# Altium schematic sheet CW340_FTDI.SchDoc: FTDI Controller
size Letter; Organization: NewAE Technology Inc.; Address1: 1083 Queen St., Suite 196; Address2: Halifax; Address3: NS; Address4: Canada B3H 0B2; DocumentNumber: .; Revision: .; SheetApproved: NO
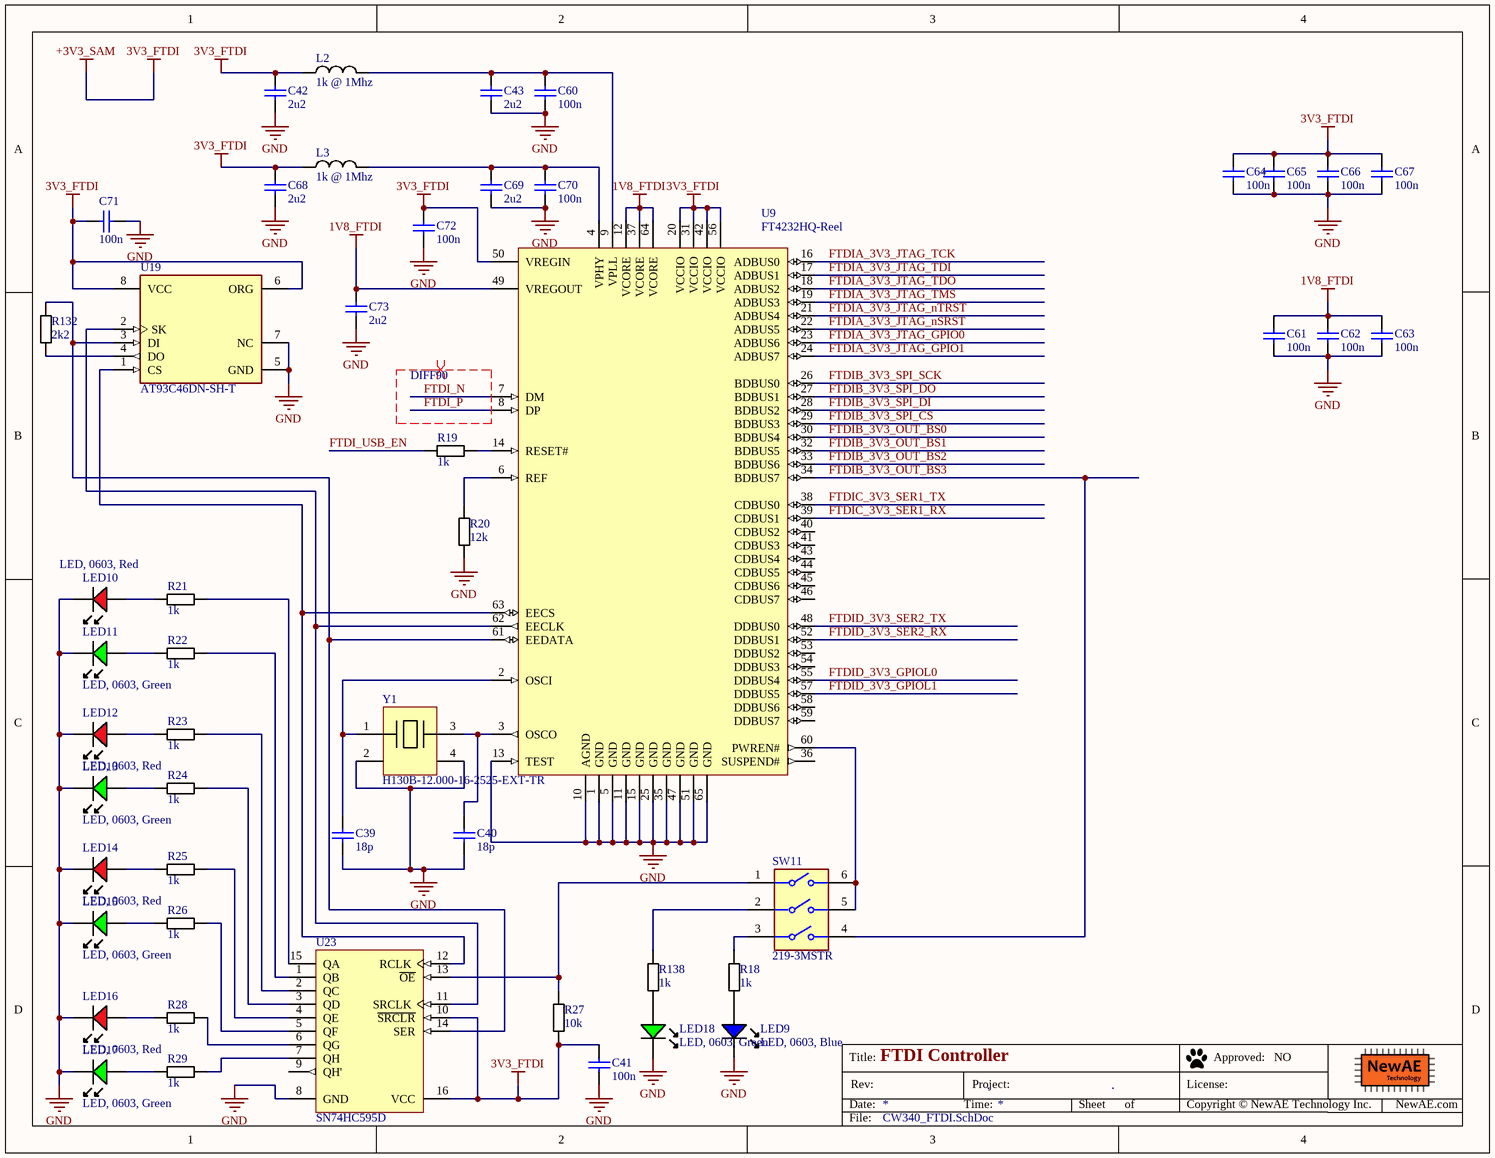
[diagram p0: CW340_FTDI.SchDoc]

## Parts
C39  18p  [CAPC0402_M]
C40  18p  [CAPC0402_M]
C41  100n  [CAPC0402_M]
C42  2u2  [CAPC0603_M]
C43  2u2  [CAPC0603_M]
C60  100n  [CAPC0402_M]
C61  100n  [CAPC0402_M]
C62  100n  [CAPC0402_M]
C63  100n  [CAPC0402_M]
C64  100n  [CAPC0402_M]
C65  100n  [CAPC0402_M]
C66  100n  [CAPC0402_M]
C67  100n  [CAPC0402_M]
C68  2u2  [CAPC0603_M]
C69  2u2  [CAPC0603_M]
C70  100n  [CAPC0402_M]
C71  100n  [CAPC0402_M]
C72  100n  [CAPC0402_M]
C73  2u2  [CAPC0603_M]
L2  1k @ 1Mhz  [IND_0603]
L3  1k @ 1Mhz  [IND_0603]
LED9  LED, 0603, Blue  [LED-0603-BLUE]
LED10  LED, 0603, Red  [LED-0603-RED]
LED11  LED, 0603, Green  [LED-0603-GREEN]
LED12  LED, 0603, Red  [LED-0603-RED]
LED13  LED, 0603, Green  [LED-0603-GREEN]
LED14  LED, 0603, Red  [LED-0603-RED]
LED15  LED, 0603, Green  [LED-0603-GREEN]
LED16  LED, 0603, Red  [LED-0603-RED]
LED17  LED, 0603, Green  [LED-0603-GREEN]
LED18  LED, 0603, Green  [LED-0603-GREEN]
R18  1k  [RESC1005X40N]
R19  1k  [RESC1005X40N]
R20  12k  [RESC1608X55N]
R21  1k  [RESC1005X40N]
R22  1k  [RESC1005X40N]
R23  1k  [RESC1005X40N]
R24  1k  [RESC1005X40N]
R25  1k  [RESC1005X40N]
R26  1k  [RESC1005X40N]
R27  10k  [RESC1005X40N]
R28  1k  [RESC1005X40N]
R29  1k  [RESC1005X40N]
R132  2k2  [RESC1005X40N]
R138  1k  [RESC1005X40N]
SW11  219-3MSTR  [FP-219-3MSTR-MFG]
U9  FT4232HQ-Reel  [QFN64_2_L]
U19  AT93C46DN-SH-T  [FP-C04-057-SN-MFG]
U23  SN74HC595D  [D0016A_L]
Y1  H130B-12.000-16-2525-EXT-TR  [5x3.2MM XTAL]

## Nets
1V8_FTDI: C61.1 C62.1 C63.1 C73.1 U9.12(VCORE) U9.37(VCORE) U9.49(VREGOUT) U9.64(VCORE)
+3V3_SAM: C41.1 C42.1 C64.1 C65.1 C66.1 C67.1 C68.1 C71.1 C72.1 L2.1 L3.1 R27.2 U9.20(VCCIO) U9.31(VCCIO) U9.42(VCCIO) U9.50(VREGIN) U9.56(VCCIO) U19.6(ORG) U19.8(VCC) U23.10(~{SRCLR}) U23.16(VCC)  [also labelled 3V3_FTDI]
GND: C39.2 C40.2 C41.2 C42.2 C43.2 C60.2 C61.2 C62.2 C63.2 C64.2 C65.2 C66.2 C67.2 C68.2 C69.2 C70.2 C71.2 C72.2 C73.2 LED9.K LED10.K LED11.K LED12.K LED13.K LED14.K LED15.K LED16.K LED17.K LED18.K R20.2 U9.1(GND) U9.5(GND) U9.10(AGND) U9.11(GND) U9.13(TEST) U9.15(GND) U9.25(GND) U9.35(GND) U9.47(GND) U9.51(GND) U9.65(GND) U19.5(GND) U19.7(NC) U23.8(GND) Y1.2 Y1.4
FTDI_N: U9.7(DM)
FTDI_P: U9.8(DP)
FTDI_USB_EN: R19.2
FTDIA_3V3_JTAG_GPIO0: U9.23(ADBUS6)
FTDIA_3V3_JTAG_GPIO1: U9.24(ADBUS7)
FTDIA_3V3_JTAG_nSRST: U9.22(ADBUS5)
FTDIA_3V3_JTAG_nTRST: U9.21(ADBUS4)
FTDIA_3V3_JTAG_TCK: U9.16(ADBUS0)
FTDIA_3V3_JTAG_TDI: U9.17(ADBUS1)
FTDIA_3V3_JTAG_TDO: U9.18(ADBUS2)
FTDIA_3V3_JTAG_TMS: U9.19(ADBUS3)
FTDIB_3V3_OUT_BS0: U9.30(BDBUS4)
FTDIB_3V3_OUT_BS1: U9.32(BDBUS5)
FTDIB_3V3_OUT_BS2: U9.33(BDBUS6)
FTDIB_3V3_OUT_BS3: SW11.4 U9.34(BDBUS7)
FTDIB_3V3_SPI_CS: U9.29(BDBUS3)
FTDIB_3V3_SPI_DI: U9.28(BDBUS2)
FTDIB_3V3_SPI_DO: U9.27(BDBUS1)
FTDIB_3V3_SPI_SCK: U9.26(BDBUS0)
FTDIC_3V3_SER1_RX: U9.39(CDBUS1)
FTDIC_3V3_SER1_TX: U9.38(CDBUS0)
FTDID_3V3_GPIOL0: U9.55(DDBUS4)
FTDID_3V3_GPIOL1: U9.57(DDBUS5)
FTDID_3V3_SER2_RX: U9.52(DDBUS1)
FTDID_3V3_SER2_TX: U9.48(DDBUS0)
NetC39_1: C39.1 U9.2(OSCI) Y1.1
NetC40_1: C40.1 U9.3(OSCO) Y1.3
NetC43_1: C43.1 C60.1 L2.2 U9.9(VPLL)
NetC69_1: C69.1 C70.1 L3.2 U9.4(VPHY)
NetLED9_A: LED9.A R18.2
NetLED10_A: LED10.A R21.2
NetLED11_A: LED11.A R22.2
NetLED12_A: LED12.A R23.2
NetLED13_A: LED13.A R24.2
NetLED14_A: LED14.A R25.2
NetLED15_A: LED15.A R26.2
NetLED16_A: LED16.A R28.2
NetLED17_A: LED17.A R29.2
NetLED18_A: LED18.A R138.2
NetR18_1: R18.1 SW11.3
NetR19_1: R19.1 U9.14(RESET#)
NetR20_1: R20.1 U9.6(REF)
NetR21_1: R21.1 U23.15(QA)
NetR22_1: R22.1 U23.1(QB)
NetR23_1: R23.1 U23.2(QC)
NetR24_1: R24.1 U23.3(QD)
NetR25_1: R25.1 U23.4(QE)
NetR26_1: R26.1 U23.5(QF)
NetR27_1: R27.1 SW11.1 U23.13(~{OE})
NetR28_1: R28.1 U23.6(QG)
NetR29_1: R29.1 U23.7(QH)
NetR132_1: R132.1 U9.61(EEDATA) U19.3(DI) U23.14(SER)
NetR132_2: R132.2 U19.4(DO)
NetR138_1: R138.1 SW11.2
NetSW11_5: SW11.5 SW11.6 U9.60(PWREN#)
NetU9_62: U9.62(EECLK) U19.2(SK) U23.11(SRCLK)
NetU9_63: U9.63(EECS) U19.1(CS) U23.12(RCLK)

Not connected (* = marked no-connect by the designer): U9 36(SUSPEND#) 40(CDBUS2) 41(CDBUS3) 43(CDBUS4) 44(CDBUS5) 45(CDBUS6) 46(CDBUS7) 53(DDBUS2) 54(DDBUS3) 58(DDBUS6) 59(DDBUS7); U23 9(QH')

## Layout directives
differential pair; differential pair class DIFF90: FTDI_N, FTDI_P

## Notes on the sheet
- Title:
- Date:
- Rev:
- Time:
- Project:
- Sheet
- of
- License:
- Copyright © NewAE Technology Inc.
- Approved:
- NewAE.com
- File:

## Library data of the parts
C39 C40 = CCHIP-18p-0402: 18p, 0402; Manufacture Part Number 1: GRM1555C1H180JA01D; Component Group: Capacitor; Case-EIA: 0402; Part Number: CCHIP-18p-0402; Footprint: 0402; Pin Count: 2; Supplier 1: Digi-Key; Supplier Part Number 1: 490-5858-1-ND; Value: 18p; Mounting Technology: SMT; Component Kind: Standard; Component Type: Standard
C41 C60-C67 C70-C72 = CCHIP-100n-0402: 100n, 0402; Manufacture Part Number 1: CGA2B3X7R1V104K050BB; Component Group: Capacitor; Case-EIA: 0402; Part Number: CCHIP-100n-0402; Footprint: 0402; Pin Count: 2; Supplier 1: Digi-Key; Supplier Part Number 1: 445-6901-1-ND; Value: 100n; Mounting Technology: SMT; Component Kind: Standard; Component Type: Standard
C42 C43 C68 C69 C73 = CCHIP-2u2-0603: 2u2, 0603; Manufacture 1: Samsung; Manufacture Part Number 1: CL10B225KP8NNNC; Component Group: Capacitor; Case-EIA: 0603; Case-Metric: 1608; Rated Voltage: 10VDC; Part Number: CCHIP-2u2-0603; Footprint: 0603; Pin Count: 2; Supplier 1: Digi-Key; Supplier Part Number 1: 1276-1134-1-ND; Value: 2u2; Mounting Technology: SMT; Component Kind: Standard; Component Type: Standard
L2 L3 = FBCHIP-1k-0603: Ferrite Beads HI CUR CHIP BD 0603 1000OHMS 25%; Manufacture 1: Taiyo Yuden; Manufacture Part Number 1: FBMH1608HM102-T / FBMH1608HM102-T / FBMH1608HM102-T / FBMH1608HM102-T; Component Group: Inductor; PP Material Stack: 0; Part Number: FBCHIP-1k-0603; Footprint: 0603; Pin Count: 2; Supplier 1: Mouser; Supplier Part Number 1: 963-FBMH1608HM102-T; Mounting Technology: SMT; RoHS: Yes; Component Kind: Standard; Component Type: Standard; PP Rotation: 0
LED9 = LEDCHIP_0603_BLUE: Chip LED, Blue; Manufacture 1: Kingbright; Manufacture Part Number 1: APT1608QBC/D; Component Group: Optical; Part Number: LEDCHIP_0603_BLUE; Pin Count: 2; Mounting Technology: SMT; Component Kind: Standard; Component Type: Standard
LED10 LED12 LED14 LED16 = LEDCHIP_0603_RED: Chip LED, Red; Manufacture 1: Kingbright; Manufacture Part Number 1: APT1608SRCPRV; Component Group: Optical; PP Material Stack: 15; PP Rotation: -90; Part Number: LEDCHIP_0603_RED; Pin Count: 2; Supplier 1: Digi-Key; Supplier Part Number 1: 754-1122-1-ND; Mounting Technology: SMT; Component Kind: Standard; Component Type: Standard
LED11 LED13 LED15 LED17 LED18 = LEDCHIP_0603_GREEN: Chip LED, Green; Manufacture 1: Kingbright; Manufacture Part Number 1: APT1608CGCK; Component Group: Optical; PP Material Stack: 16; PP Rotation: -90; Part Number: LEDCHIP_0603_GREEN; Pin Count: 2; Supplier 1: Digi-Key; Supplier Part Number 1: 754-1116-1-ND; Mounting Technology: SMT; Component Kind: Standard; Component Type: Standard
R18 R19 R21-R26 R28 R29 R138 = RCHIP-1K-0402: 1k res, 0402, 1%, 1/16W; Manufacture 1: Yageo; Manufacture Part Number 1: RC0402FR-071KL; Component Group: Resistor; Case-EIA: 0402; Case-Metric: 1005; Rated Power: 0.063W; Rated Voltage: 75VDC; Part Number: RCHIP-1K-0402; Footprint: 0402; Pin Count: 2; Supplier 1: Digi-Key; Supplier Part Number 1: 311-1.00KLRCT-ND; Value: 1k; Tolerance: 1%; Mounting Technology: SMT; Temperature Range: -55C to 155C; Component Kind: Standard; Component Type: Standard
R20 = RCHIP-12K-0603: 12k res, 0603, 1%, 1/10W; Manufacture 1: Yageo; Manufacture Part Number 1: RC0603FR-0712KL; Component Group: Resistor; Case-EIA: 0603; Case-Metric: 1608; Rated Power: 0.1W; Rated Voltage: 75VDC; Part Number: RCHIP-12K-0603; Footprint: 0603; Pin Count: 2; Supplier 1: Digi-Key; Supplier Part Number 1: 311-12.0KHRCT-ND; Value: 12k; Tolerance: 1%; Mounting Technology: SMT; Temperature Range: -55C to 155C; Component Kind: Standard; Component Type: Standard
R27 = RCHIP-10K-0402: 10k res, 0402, 1%, 1/16W; Manufacture 1: Yageo; Manufacture Part Number 1: RC0402FR-0710KL; Component Group: Resistor; Case-EIA: 0402; Case-Metric: 1005; Rated Power: 0.063W; Rated Voltage: 75VDC; Part Number: RCHIP-10K-0402; Footprint: 0402; Pin Count: 2; Supplier 1: Digi-Key; Supplier Part Number 1: 311-10.0KLRCT-ND; Value: 10k; Tolerance: 1%; Mounting Technology: SMT; Temperature Range: -55C to 155C; Component Kind: Standard; Component Type: Standard
R132 = RCHIP-2K2-0402: 2k2 res, 0402, 1%, 1/16W; Manufacture 1: Yageo; Manufacture Part Number 1: RC0402FR-072K2L; Component Group: Resistor; Case-EIA: 0402; Case-Metric: 1005; Rated Power: 0.063W; Rated Voltage: 75VDC; Part Number: RCHIP-2K2-0402; Footprint: 0402; Pin Count: 2; Supplier 1: Digi-Key; Supplier Part Number 1: 311-2.20KLRCT-ND; Value: 2k2; Tolerance: 1%; Mounting Technology: SMT; Temperature Range: -55C to 155C; Component Kind: Standard; Component Type: Standard
SW11 = CMP-07018-000004-1: SWITCH SLIDE DIP SPST 100MA 20V; Washable: Yes; Mechanical Life: 2000Cycles; Number of Positions: 3; Pitch: 0.1inch; Actuator Type: Slide (Standard); Max Operating Temperature: 85°C; Voltage Rating (DC): 20V; Termination: Gull Wing; Length: 0.358inch; Min Operating Temperature: -55°C; Orientation: Straight; Mount: Surface Mount; Package Quantity: 1000; Current Rating: 100mA; Electrical Life: 2000Cycles; Max Current Rating: 100mA; Throw Configuration: SPST; Contact Material: Copper; Packaging: Tape and Reel; Contact Plating: Gold; Lead Free: Lead Free; Max Voltage Rating (DC): 20V
U9 = CMP-0078-00005-3: Quad High Speed USB To Multipurpose UART/MPSSE IC, 64-pin QFN, Tape and Reel; Manufacturer: FTDI; ComponentLink1URL: http://www.ftdichip.com/; ComponentLink2Description: Datasheet; ComponentLink2URL: http://www.ftdichip.com/Support/Documents/DataSheets/ICs/DS_FT4232H.pdf; PackageReference: QFN64_2; DatasheetVersion: ver 2.2, Jan-2012; PackageDescription: 64-Pin Quad Flat No-Lead, 9 x 9 mm Body, 0.5 mm Pitch, 4.35 x 4.35 mm Exposed Pad; RevisionNote: DatasheetVersion updated to 2.2 Jan-2012; PartNumber: FT4232HQ-Reel; PackageVersion: Jan-12; ComponentLink1Description: Manufacturer URL
U19 = CMP-06313-000016-1: IC EEPROM 1K SPI 2MHZ 8SOIC; Manufacturer: Microchip; Nominal Supply Current: 0.5mA; Memory Size: 1Kbits; Access Time: 1000ns; Max Supply Voltage: 5.5V; Interface: Other; Standoff Height: 0.1mm; Min Supply Voltage: 1.8V; Category: IC; Temperature Range High: +85°C; Mouser Description: EEPROM Serial-3Wire 1K-Bit 128 x 8/64 x 16 2.5V/3.3V/5V 8-Pin SOIC T/R; Ipc Land Pattern Name: SOIC127P600X175-8; Temperature Range Low: -40°C; Temperature: -40°C to +85°C; Digikey Description: IC EEPROM 1K SPI 2MHZ 8SOIC; Lead Free: Yes; Device Class L2: Memory; ComponentLink2URL: http://ww1.microchip.com/downloads/en/DeviceDoc/20006224B.pdf; Automotive: No; Device Class L3: EEPROM; Package: C04-057-SN; Octopart: https://octopart.com/at93c46dn-sh-t-microchip-77759177; RoHS: TRUE; Memory Type: EEPROM; Height: 1.75mm; Manufacturer Part Number: AT93C46DN-SH-T; ComponentLink2Description: Datasheet; Frequency: 2MHz; Device Class L1: Integrated Circuits (ICs)
U23 = CMP-0780-00038-3: 8-Bit Shift Registers With 3-State Output Registers, D0016A, TUBE; Manufacturer: Texas Instruments; Bits: 8; F @ Nom Voltage(Max)(Mhz): 28; Voltage(Nom)(V): 6; ICC @ Nom Voltage(Max)(mA): 0.08; Output Drive (IOL/IOH)(Max)(mA): 7.8/-7.8; tpd @ Nom Voltage(Max)(ns): 34; 3-State Output: Yes; VCC(Min)(V): 2; Output Type: CMOS; Technology Family: HC; Rating: Military; Generic Part Number: SN74HC595; PackageReference: D0016A; Code_JEDEC: MS-012 variation AC; Operating Temperature Range(C): -40 to 85; VCC(Max)(V): 6; DatasheetVersion: SCLS041H; Input Type: CMOS; PackageVersion: http://www.ti.com/lit/ml/mpds178g/mpds178g.pdf
Y1 = H130B-12.000-16-2525-EXT-TR: 12MHz ±25ppm Crystal 16pF 35 Ohms 4-SMD, No Lead; Manufacture 1: Raltron Electronics; Value: 12.000MHz; PP Material Stack: 0; Supplier 1: Digi-Key; Stock 1: 4955; Pricing 1: 1=0.590000, 10=0.488000, 50=0.439400, 100=0.390600, 500=0.371100 (USD); Supplier Part Number 1: 2151-H130B-12.000-16-2525-EXT-TR-ND; .Checked SCH: *; .Checked PCB: *; Manufacturer Part Number: H130B-12.000-16-2525-EXT-TR; Part Number: H130B-12.000-16-2525-EXT-TR; Component Group: Crystal; Footprint: 5x3.2mm; Manufacture Part Number 1: H130B-12.000-16-2525-EXT-TR; Pin Count: 4; Mounting Technology: SMT; Component Kind: Standard; Component Type: Standard; PP Rotation: 0